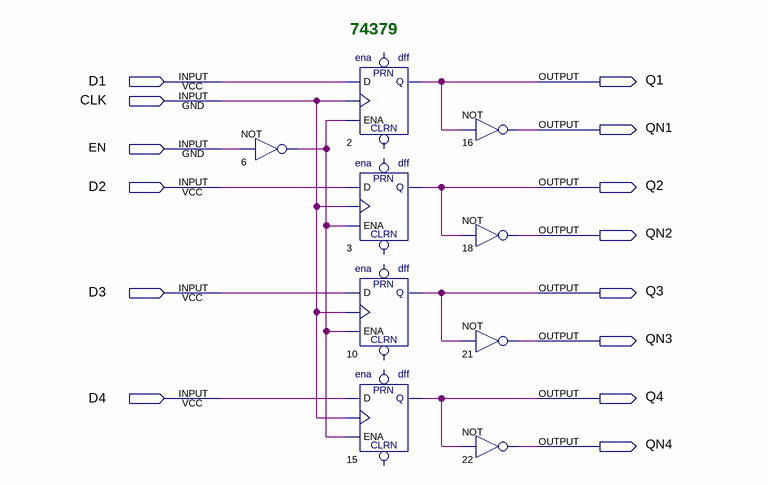
[diagram p0: schematic sheet]
// Quartus schematic 74379.bdf as structural Verilog: 9 symbols, 14 pins
module \74379  (
  input  D1,
  input  CLK,
  input  EN,
  input  D2,
  input  D3,
  input  D4,
  output Q1,
  output QN1,
  output Q2,
  output QN2,
  output Q3,
  output QN3,
  output Q4,
  output QN4
);

  wire n6_out;

  not u_6 (n6_out, EN);
  enadff u_2 (.ENA(n6_out), .D(D1), .CLK(CLK), .Q(Q1));  // open: PRN, CLRN
  enadff u_3 (.ENA(n6_out), .D(D2), .CLK(CLK), .Q(Q2));  // open: PRN, CLRN
  enadff u_10 (.ENA(n6_out), .D(D3), .CLK(CLK), .Q(Q3));  // open: PRN, CLRN
  enadff u_15 (.ENA(n6_out), .D(D4), .CLK(CLK), .Q(Q4));  // open: PRN, CLRN
  not u_16 (QN1, Q1);
  not u_18 (QN2, Q2);
  not u_21 (QN3, Q3);
  not u_22 (QN4, Q4);

  // Notes on the sheet:
  //   74379
endmodule
